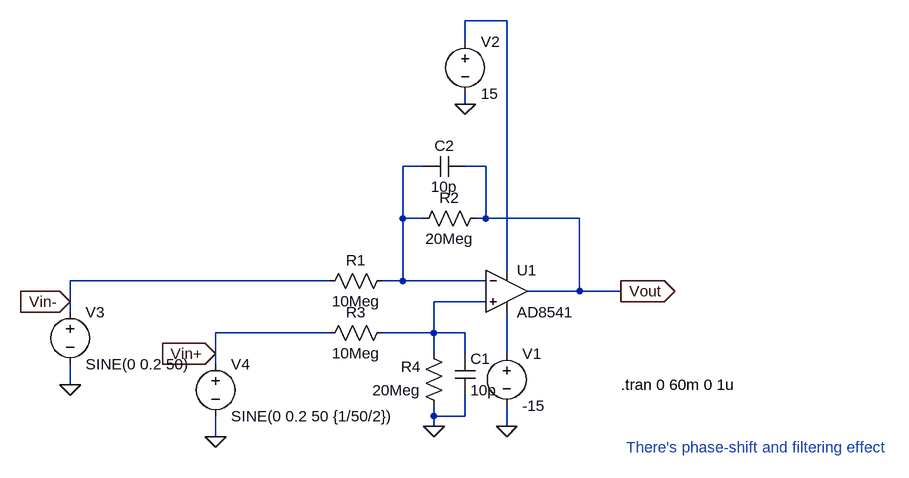
[diagram p0: schematic 004-low-power-difference-amplifier.asc]
004-low-power-difference-amplifier.asc, the LTspice schematic file:
Version 4
SHEET 1 880 680
WIRE -368 -336 -432 -336
WIRE -432 -304 -432 -336
WIRE -432 -208 -432 -224
WIRE -496 -112 -528 -112
WIRE -400 -112 -432 -112
WIRE -528 -32 -528 -112
WIRE -496 -32 -528 -32
WIRE -400 -32 -400 -112
WIRE -400 -32 -416 -32
WIRE -256 -32 -400 -32
WIRE -368 48 -368 -336
WIRE -640 64 -1040 64
WIRE -528 64 -528 -32
WIRE -528 64 -560 64
WIRE -400 64 -528 64
WIRE -256 80 -256 -32
WIRE -256 80 -336 80
WIRE -192 80 -256 80
WIRE -1040 96 -1040 64
WIRE -400 96 -480 96
WIRE -1040 112 -1040 96
WIRE -640 144 -816 144
WIRE -480 144 -480 96
WIRE -480 144 -560 144
WIRE -432 144 -480 144
WIRE -816 176 -816 144
WIRE -480 176 -480 144
WIRE -432 176 -432 144
WIRE -368 176 -368 112
WIRE -816 192 -816 176
WIRE -1040 224 -1040 192
WIRE -480 272 -480 256
WIRE -432 272 -432 240
WIRE -432 272 -480 272
WIRE -480 288 -480 272
WIRE -368 288 -368 256
WIRE -816 304 -816 272
FLAG -368 288 0
FLAG -432 -208 0
FLAG -1040 96 Vin-
IOPIN -1040 96 In
FLAG -192 80 Vout
IOPIN -192 80 Out
FLAG -1040 224 0
FLAG -480 288 0
FLAG -816 176 Vin+
IOPIN -816 176 In
FLAG -816 304 0
SYMBOL Opamps\\AD8541 -368 16 R0
SYMATTR InstName U1
SYMBOL voltage -368 160 R0
SYMATTR InstName V1
SYMATTR Value -15
SYMBOL voltage -432 -320 R0
SYMATTR InstName V2
SYMATTR Value 15
SYMBOL res -544 48 R90
WINDOW 0 0 56 VBottom 2
WINDOW 3 32 56 VTop 2
SYMATTR InstName R1
SYMATTR Value 10Meg
SYMBOL res -400 -48 R90
WINDOW 0 0 56 VBottom 2
WINDOW 3 32 56 VTop 2
SYMATTR InstName R2
SYMATTR Value 20Meg
SYMBOL voltage -1040 96 R0
WINDOW 123 0 0 Left 2
WINDOW 39 0 0 Left 2
SYMATTR InstName V3
SYMATTR Value SINE(0 0.2 50)
SYMBOL res -544 128 R90
WINDOW 0 0 56 VBottom 2
WINDOW 3 32 56 VTop 2
SYMATTR InstName R3
SYMATTR Value 10Meg
SYMBOL res -464 272 R180
WINDOW 0 36 76 Left 2
WINDOW 3 36 40 Left 2
SYMATTR InstName R4
SYMATTR Value 20Meg
SYMBOL voltage -816 176 R0
WINDOW 123 0 0 Left 2
WINDOW 39 0 0 Left 2
SYMATTR InstName V4
SYMATTR Value SINE(0 0.2 50 {1/50/2})
SYMBOL cap -448 176 R0
SYMATTR InstName C1
SYMATTR Value 10p
SYMBOL cap -432 -128 R90
WINDOW 0 0 32 VBottom 2
WINDOW 3 32 32 VTop 2
SYMATTR InstName C2
SYMATTR Value 10p
TEXT -192 224 Left 2 !.tran 0 60m 0 1u
TEXT -184 320 Left 2 ;There's phase-shift and filtering effect

The netlist it stands for:
* 004-low-power-difference-amplifier.asc
XU1 N003 N002 N001 N004 Vout AD8541  ; pins In+ In- V+ V- OUT
V1 N004 0 -15
V2 N001 0 15
R1 N002 Vin- 10Meg
R2 Vout N002 20Meg
V3 Vin- 0 SINE(0 0.2 50)
R3 N003 Vin+ 10Meg
R4 0 N003 20Meg
V4 Vin+ 0 SINE(0 0.2 50 {1/50/2})
C1 N003 0 10p
C2 Vout N002 10p
.tran 0 60m 0 1u
* There's phase-shift and filtering effect
.backanno
.end